# Altium project STM32H743XIH6 SOM Bd.PrjPcb (part 2 of 2)
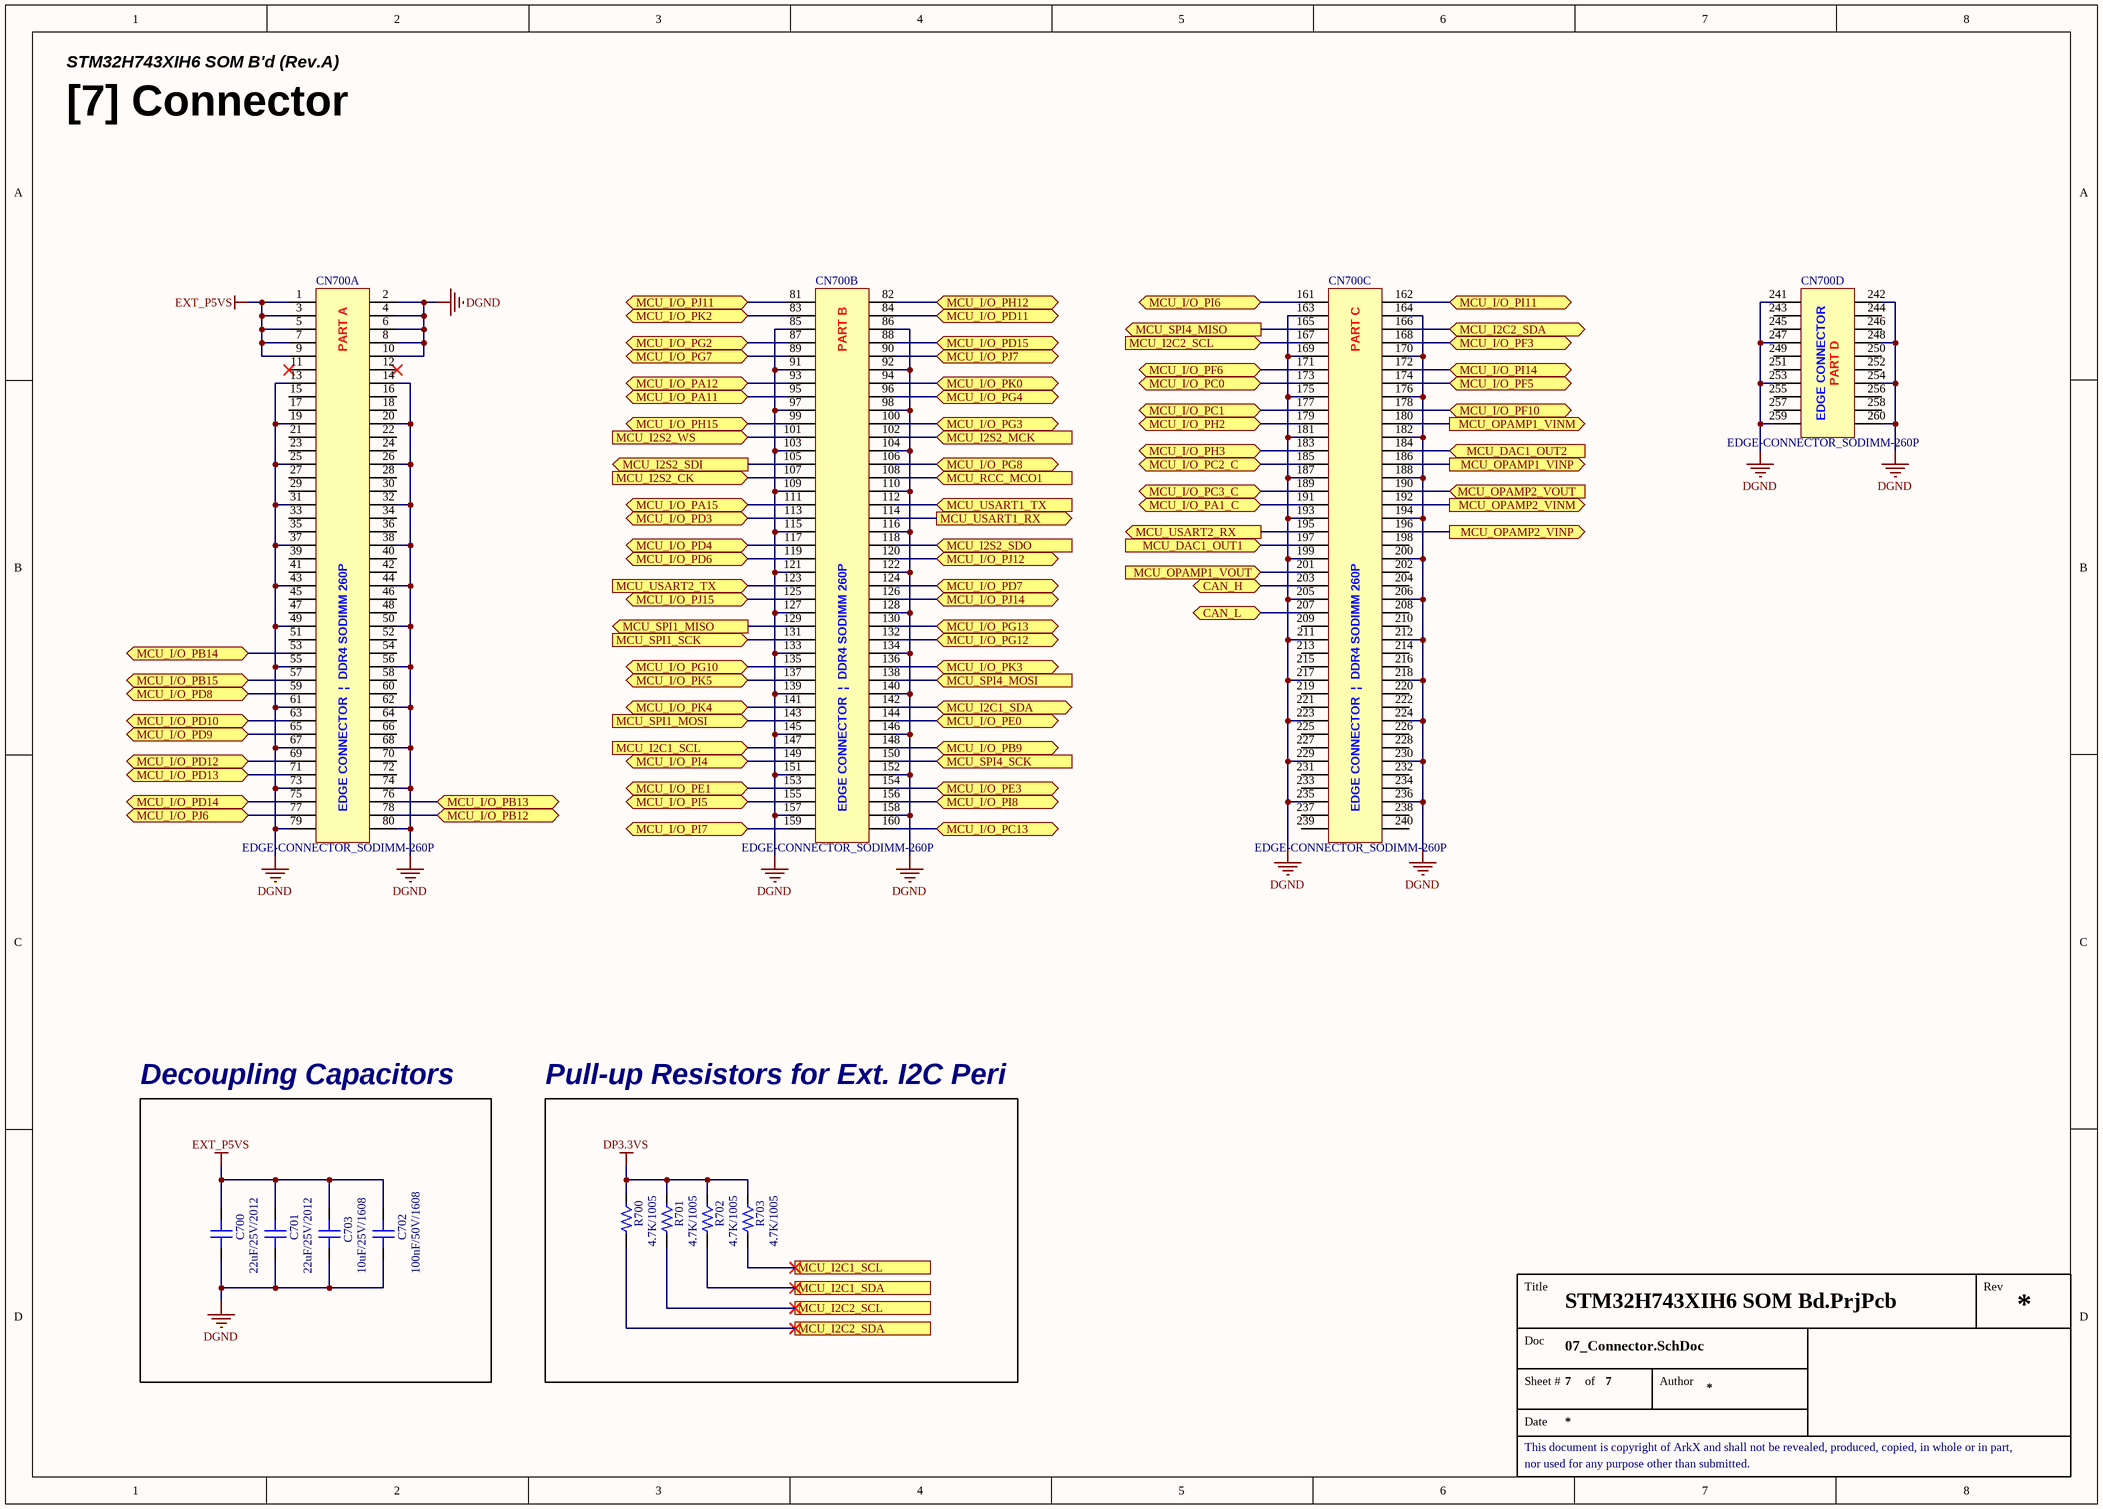
[diagram p7: 07_Connector.SchDoc]

## Nets that join several sheets
DGND: 03_Power (22 pins), 04_MCU-Part1 (14 pins), 05_MCU-Part2 (14 pins), 06_MCU_Part3 (91 pins), 07_Connector (93 pins)
DP3.3VS: 03_Power (LED300.4 R304.2 R307.2), 04_MCU-Part1 (19 pins), 05_MCU-Part2 (8 pins), 06_MCU_Part3 (63 pins), 07_Connector (R700.1 R701.1 R702.1 R703.1)
DP5VS: 03_Power (6 pins), 06_MCU_Part3 (R602.1)
EXT_P5VS: 03_Power (D300.1 SB302.1), 07_Connector (9 pins)
CAN_H: 06_MCU_Part3 (R600.2 U601.7 ZD600.1), 07_Connector (CN700.203)
CAN_L: 06_MCU_Part3 (R600.1 U601.6 ZD600.2), 07_Connector (CN700.207)
MCU_DAC1_OUT1: 04_MCU-Part1 (U400.U3), 07_Connector (CN700.197)
MCU_DAC1_OUT2: 04_MCU-Part1 (U400.T3), 07_Connector (CN700.184)
MCU_FDCAN1_RX: 05_MCU-Part2 (U400.B17), 06_MCU_Part3 (U601.4)
MCU_FDCAN1_TX: 05_MCU-Part2 (U400.D16), 06_MCU_Part3 (U601.1)
MCU_I2C1_SCL: 04_MCU-Part1 (U400.B5), 07_Connector (CN700.147 R703.2)
MCU_I2C1_SDA: 04_MCU-Part1 (U400.C5), 07_Connector (CN700.142 R702.2)
MCU_I2C2_SCL: 05_MCU-Part2 (U400.G3), 07_Connector (CN700.167 R701.2)
MCU_I2C2_SDA: 05_MCU-Part2 (U400.G4), 07_Connector (CN700.166 R700.2)
MCU_I2C3_SCL: 04_MCU-Part1 (R411.1 U401.6), 05_MCU-Part2 (U400.U13)
MCU_I2C3_SDA: 04_MCU-Part1 (R412.1 U401.5), 05_MCU-Part2 (U400.T13)
MCU_I2S2_CK: 05_MCU-Part2 (U400.A15), 07_Connector (CN700.107)
MCU_I2S2_MCK: 04_MCU-Part1 (U400.F14), 07_Connector (CN700.102)
MCU_I2S2_SDI: 05_MCU-Part2 (U400.B15), 07_Connector (CN700.105)
MCU_I2S2_SDO: 05_MCU-Part2 (U400.C14), 07_Connector (CN700.118)
MCU_I2S2_WS: 05_MCU-Part2 (U400.A16), 07_Connector (CN700.101)
MCU_I/O_PA1_C: 04_MCU-Part1 (U400.T2), 07_Connector (CN700.191)
MCU_I/O_PA11: 04_MCU-Part1 (U400.E17), 07_Connector (CN700.95)
MCU_I/O_PA12: 04_MCU-Part1 (U400.E16), 07_Connector (CN700.93)
MCU_I/O_PA15: 04_MCU-Part1 (U400.A14), 07_Connector (CN700.111)
MCU_I/O_PB9: 04_MCU-Part1 (U400.D4), 07_Connector (CN700.148)
MCU_I/O_PB12: 04_MCU-Part1 (U400.T14), 07_Connector (CN700.78)
MCU_I/O_PB13: 04_MCU-Part1 (U400.U14), 07_Connector (CN700.76)
MCU_I/O_PB14: 04_MCU-Part1 (U400.U15), 07_Connector (CN700.53)
MCU_I/O_PB15: 04_MCU-Part1 (U400.T15), 07_Connector (CN700.57)
MCU_I/O_PC0: 04_MCU-Part1 (U400.L2), 07_Connector (CN700.173)
MCU_I/O_PC1: 04_MCU-Part1 (U400.M2), 07_Connector (CN700.177)
MCU_I/O_PC2_C: 04_MCU-Part1 (U400.R1), 07_Connector (CN700.185)
MCU_I/O_PC3_C: 04_MCU-Part1 (U400.R2), 07_Connector (CN700.189)
MCU_I/O_PC13: 04_MCU-Part1 (U400.E3), 07_Connector (CN700.160)
MCU_I/O_PD3: 05_MCU-Part2 (U400.B12), 07_Connector (CN700.113)
MCU_I/O_PD4: 05_MCU-Part2 (U400.A12), 07_Connector (CN700.117)
MCU_I/O_PD6: 05_MCU-Part2 (U400.B11), 07_Connector (CN700.119)
MCU_I/O_PD7: 05_MCU-Part2 (U400.C11), 07_Connector (CN700.124)
MCU_I/O_PD8: 05_MCU-Part2 (U400.U16), 07_Connector (CN700.59)
MCU_I/O_PD9: 05_MCU-Part2 (U400.T17), 07_Connector (CN700.65)
MCU_I/O_PD10: 05_MCU-Part2 (U400.T16), 07_Connector (CN700.63)
MCU_I/O_PD11: 05_MCU-Part2 (U400.R15), 07_Connector (CN700.84)
MCU_I/O_PD12: 05_MCU-Part2 (U400.R16), 07_Connector (CN700.69)
MCU_I/O_PD13: 05_MCU-Part2 (U400.R17), 07_Connector (CN700.71)
MCU_I/O_PD14: 05_MCU-Part2 (U400.P16), 07_Connector (CN700.75)
MCU_I/O_PD15: 05_MCU-Part2 (U400.P15), 07_Connector (CN700.88)
MCU_I/O_PE0: 05_MCU-Part2 (U400.C4), 07_Connector (CN700.144)
MCU_I/O_PE1: 05_MCU-Part2 (U400.B4), 07_Connector (CN700.153)
MCU_I/O_PE3: 05_MCU-Part2 (U400.D3), 07_Connector (CN700.154)
MCU_I/O_PF3: 05_MCU-Part2 (U400.H4), 07_Connector (CN700.168)
MCU_I/O_PF5: 05_MCU-Part2 (U400.J4), 07_Connector (CN700.174)
MCU_I/O_PF6: 05_MCU-Part2 (U400.K2), 07_Connector (CN700.171)
MCU_I/O_PF10: 05_MCU-Part2 (U400.L3), 07_Connector (CN700.178)
MCU_I/O_PG2: 05_MCU-Part2 (U400.H16), 07_Connector (CN700.87)
MCU_I/O_PG3: 05_MCU-Part2 (U400.H15), 07_Connector (CN700.100)
MCU_I/O_PG4: 05_MCU-Part2 (U400.H14), 07_Connector (CN700.96)
MCU_I/O_PG7: 05_MCU-Part2 (U400.F16), 07_Connector (CN700.89)
MCU_I/O_PG8: 05_MCU-Part2 (U400.F15), 07_Connector (CN700.106)
MCU_I/O_PG10: 05_MCU-Part2 (U400.A9), 07_Connector (CN700.135)
MCU_I/O_PG12: 05_MCU-Part2 (U400.C9), 07_Connector (CN700.132)
MCU_I/O_PG13: 05_MCU-Part2 (U400.D9), 07_Connector (CN700.130)
MCU_I/O_PH2: 05_MCU-Part2 (U400.N2), 07_Connector (CN700.179)
MCU_I/O_PH3: 05_MCU-Part2 (U400.P2), 07_Connector (CN700.183)
MCU_I/O_PH12: 05_MCU-Part2 (U400.R14), 07_Connector (CN700.82)
MCU_I/O_PH15: 05_MCU-Part2 (U400.B16), 07_Connector (CN700.99)
MCU_I/O_PI4: 05_MCU-Part2 (U400.A4), 07_Connector (CN700.149)
MCU_I/O_PI5: 05_MCU-Part2 (U400.A3), 07_Connector (CN700.155)
MCU_I/O_PI6: 05_MCU-Part2 (U400.A2), 07_Connector (CN700.161)
MCU_I/O_PI7: 05_MCU-Part2 (U400.B3), 07_Connector (CN700.159)
MCU_I/O_PI8: 05_MCU-Part2 (U400.E4), 07_Connector (CN700.156)
MCU_I/O_PI11: 05_MCU-Part2 (U400.F4), 07_Connector (CN700.162)
MCU_I/O_PI14: 05_MCU-Part2 (U400.H3), 07_Connector (CN700.172)
MCU_I/O_PJ6: 05_MCU-Part2 (U400.N15), 07_Connector (CN700.77)
MCU_I/O_PJ7: 05_MCU-Part2 (U400.N14), 07_Connector (CN700.90)
MCU_I/O_PJ11: 05_MCU-Part2 (U400.K14), 07_Connector (CN700.81)
MCU_I/O_PJ12: 05_MCU-Part2 (U400.D11), 07_Connector (CN700.120)
MCU_I/O_PJ14: 05_MCU-Part2 (U400.D10), 07_Connector (CN700.126)
MCU_I/O_PJ15: 05_MCU-Part2 (U400.B10), 07_Connector (CN700.125)
MCU_I/O_PK0: 05_MCU-Part2 (U400.J14), 07_Connector (CN700.94)
MCU_I/O_PK2: 05_MCU-Part2 (U400.H17), 07_Connector (CN700.83)
MCU_I/O_PK3: 05_MCU-Part2 (U400.C8), 07_Connector (CN700.136)
MCU_I/O_PK4: 05_MCU-Part2 (U400.B8), 07_Connector (CN700.141)
MCU_I/O_PK5: 05_MCU-Part2 (U400.A8), 07_Connector (CN700.137)
MCU_LED1_BLUE: 04_MCU-Part1 (R410.2), 05_MCU-Part2 (U400.U8)
MCU_LED1_GREEN: 04_MCU-Part1 (R409.2), 05_MCU-Part2 (U400.U7)
MCU_LED1_RED: 04_MCU-Part1 (R408.2), 05_MCU-Part2 (U400.U6)
MCU_LED2_BLUE: 04_MCU-Part1 (R416.2), 05_MCU-Part2 (U400.T8)
MCU_LED2_GREEN: 04_MCU-Part1 (R415.2), 05_MCU-Part2 (U400.T7)
MCU_LED2_RED: 04_MCU-Part1 (R414.2), 05_MCU-Part2 (U400.T6)
MCU_OPAMP1_VINM: 04_MCU-Part1 (U400.R5), 07_Connector (CN700.180)
MCU_OPAMP1_VINP: 04_MCU-Part1 (U400.U5), 07_Connector (CN700.186)
MCU_OPAMP1_VOUT: 04_MCU-Part1 (U400.T4), 07_Connector (CN700.201)
MCU_OPAMP2_VINM: 05_MCU-Part2 (U400.T9), 07_Connector (CN700.192)
MCU_OPAMP2_VINP: 05_MCU-Part2 (U400.P9), 07_Connector (CN700.196)
MCU_OPAMP2_VOUT: 05_MCU-Part2 (U400.U9), 07_Connector (CN700.190)
MCU_RCC_MCO1: 04_MCU-Part1 (U400.E15), 07_Connector (CN700.108)
MCU_SDMMC1_CK: 04_MCU-Part1 (U400.C12), 06_MCU_Part3 (CN600.5 R610.1)
MCU_SDMMC1_CMD: 05_MCU-Part2 (U400.D12), 06_MCU_Part3 (CN600.3 R609.1)
MCU_SDMMC1_D0: 04_MCU-Part1 (U400.E13), 06_MCU_Part3 (CN600.7 R608.1)
MCU_SDMMC1_D1: 04_MCU-Part1 (U400.E14), 06_MCU_Part3 (CN600.8 R607.1)
MCU_SDMMC1_D2: 04_MCU-Part1 (U400.A13), 06_MCU_Part3 (CN600.1 R606.1)
MCU_SDMMC1_D3: 04_MCU-Part1 (U400.B13), 06_MCU_Part3 (CN600.2 R605.1)
MCU_SPI1_MISO: 05_MCU-Part2 (U400.A10), 07_Connector (CN700.129)
MCU_SPI1_MOSI: 04_MCU-Part1 (U400.A5), 07_Connector (CN700.143)
MCU_SPI1_SCK: 05_MCU-Part2 (U400.B9), 07_Connector (CN700.131)
MCU_SPI4_MISO: 05_MCU-Part2 (U400.D1), 07_Connector (CN700.165)
MCU_SPI4_MOSI: 05_MCU-Part2 (U400.E5), 07_Connector (CN700.138)
MCU_SPI4_SCK: 05_MCU-Part2 (U400.C3), 07_Connector (CN700.150)
MCU_USART1_RX: 04_MCU-Part1 (U400.D14), 07_Connector (CN700.114)
MCU_USART1_TX: 04_MCU-Part1 (U400.D15), 07_Connector (CN700.112)
MCU_USART2_RX: 04_MCU-Part1 (U400.U2), 07_Connector (CN700.195)
MCU_USART2_TX: 05_MCU-Part2 (U400.A11), 07_Connector (CN700.123)